# EAGLE design 8255_pio_1_4 (EAGLE 9.6.2)
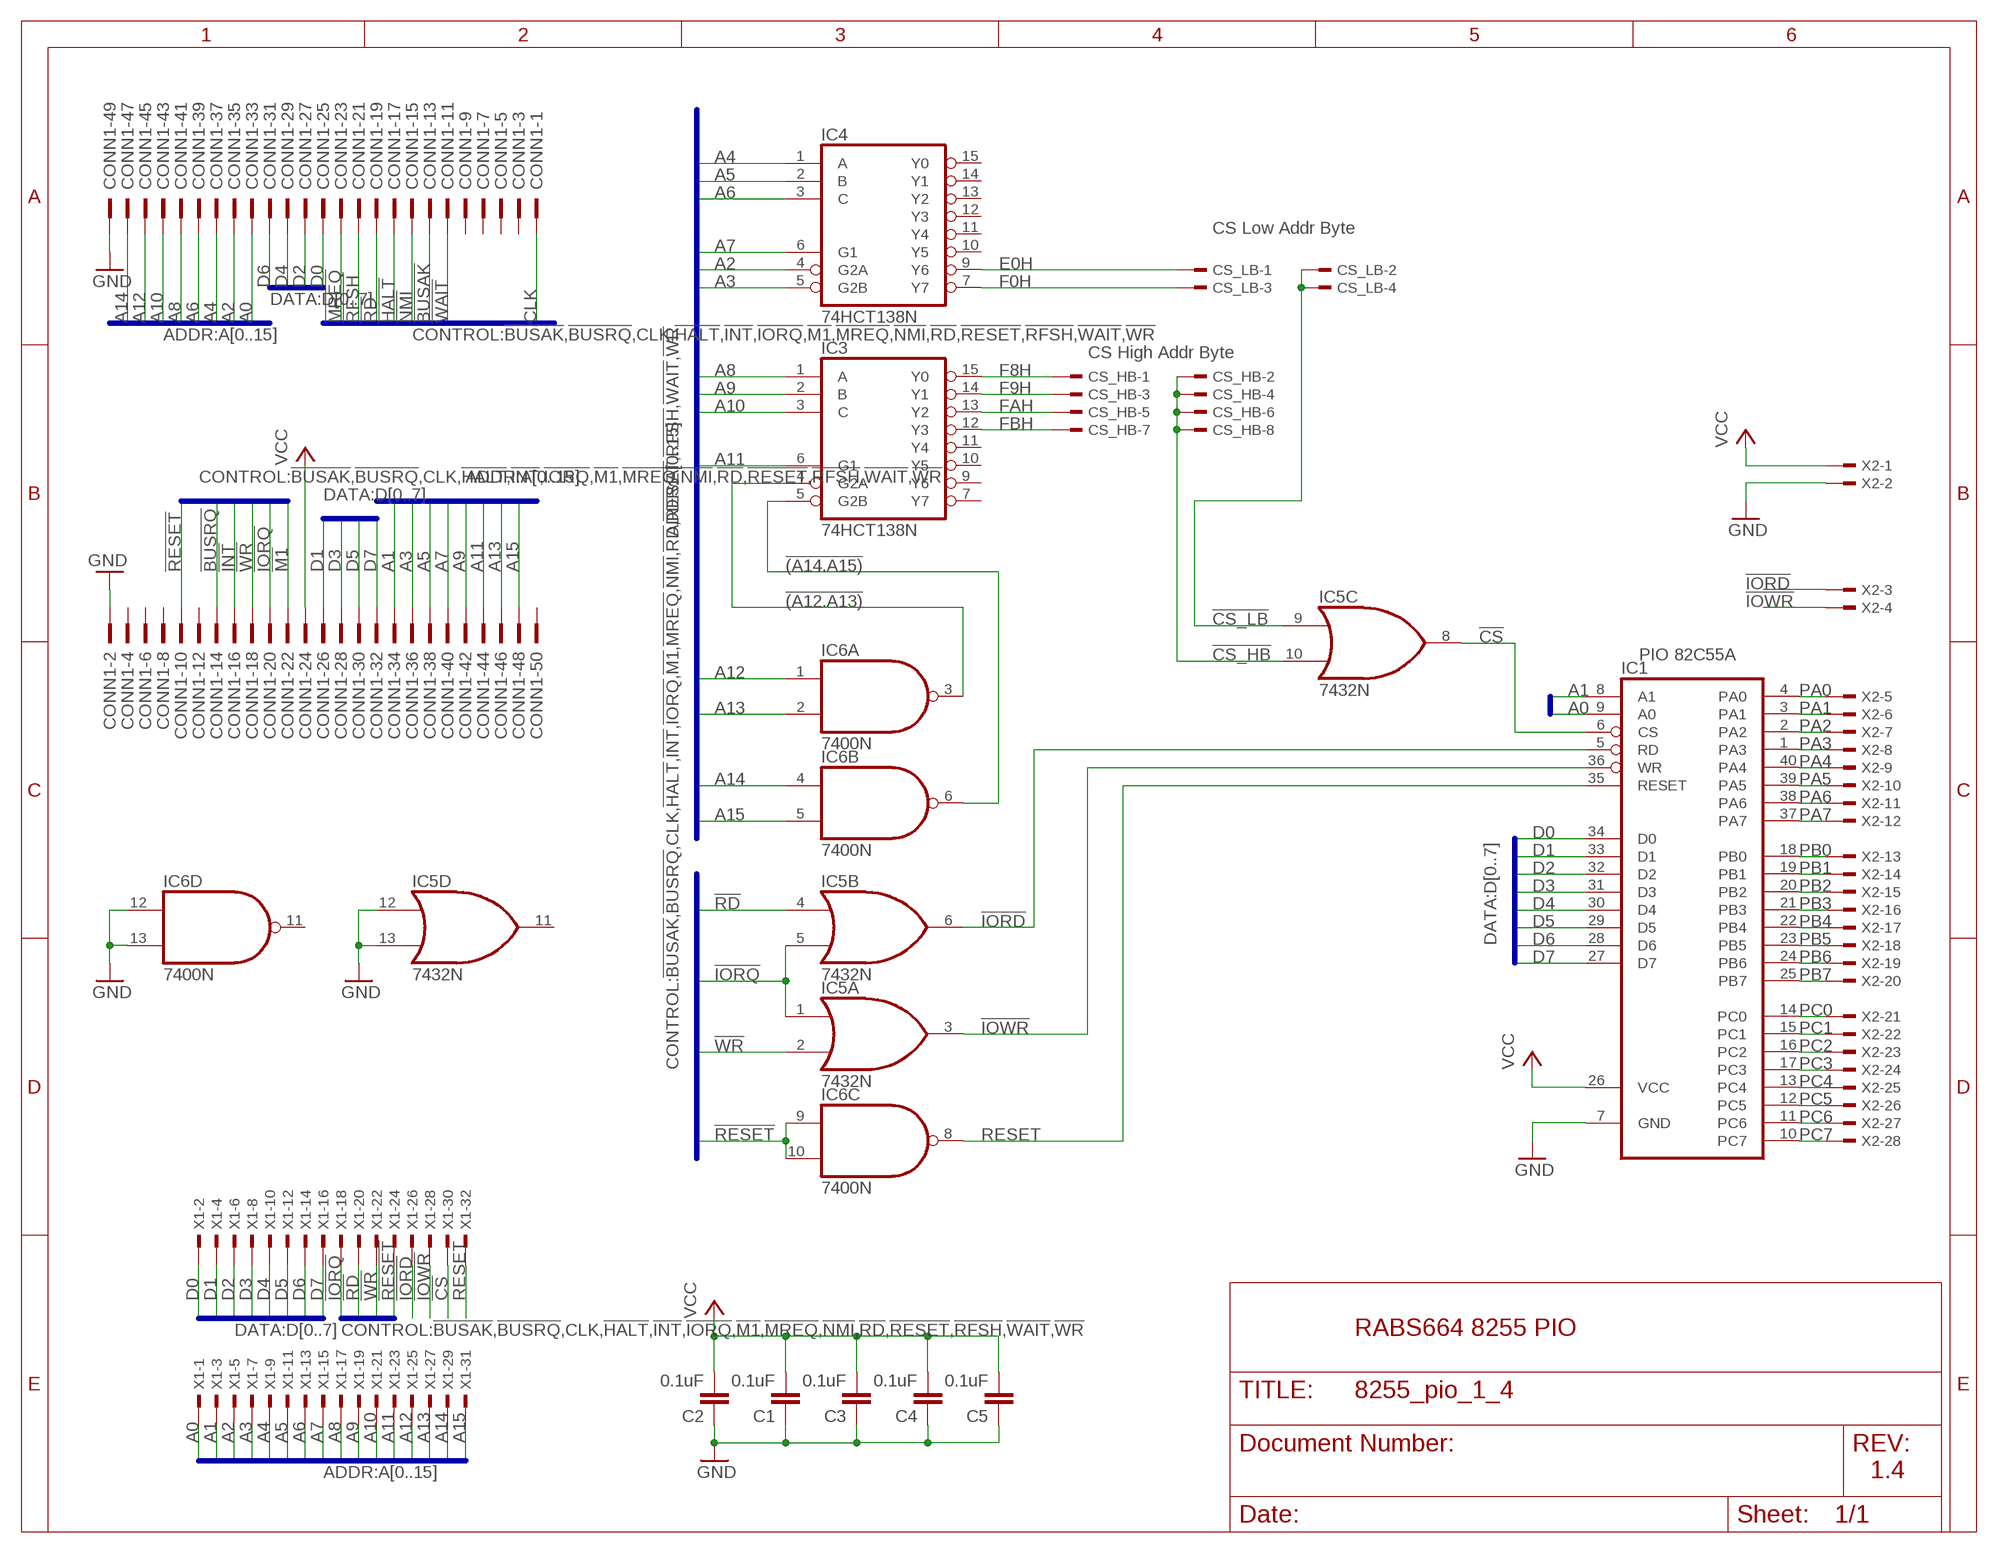
[diagram p0: schematic, sheet 1]

## Parts
C1  0.1uF  C-EU050-025X075  [C050-025X075]
C2  0.1uF  C-EU050-025X075  [C050-025X075]
C3  0.1uF  C-EU050-025X075  [C050-025X075]
C4  0.1uF  C-EU050-025X075  [C050-025X075]
C5  0.1uF  C-EU050-025X075  [C050-025X075]
CONN1  2550-  [PAK100/2500-50]
CS_HB  TSW-104-07-G-D  [TSW-104-XX-G-D]
CS_LB  TSW-102-07-G-D  [TSW-102-XX-G-D]
IC1  82C55A  [DIL40]
IC3  74HCT138N  [DIL16]
IC4  74HCT138N  [DIL16]
IC5  7432N  [DIL14]
IC6  7400N  [DIL14]
X1  TSW-116-07-G-D  [TSW-116-XX-G-D]
X2  TSW-128-07-G-S  [TSW-128-XX-G-S]

## Nets
!(A12.A13): IC3.4(G2A) IC6.3(A:O)
!(A14.A15): IC3.5(G2B) IC6.6(B:O)
!BUSAK: CONN1.13
!BUSRQ: CONN1.14
!CS: IC1.6(CS) IC5.8(C:O) X1.30
!CS_HB: CS_HB.2 CS_HB.4 CS_HB.6 CS_HB.8 IC5.10(C:I1)
!CS_LB: CS_LB.2 CS_LB.4 IC5.9(C:I0)
!HALT: CONN1.17
!INT: CONN1.16
!IORD: IC1.5(RD) IC5.6(B:O) X1.26 X2.3
!IORQ: CONN1.20 IC5.1(A:I0) IC5.5(B:I1) X1.18
!IOWR: IC1.36(WR) IC5.3(A:O) X1.28 X2.4
!M1: CONN1.22
!MREQ: CONN1.23
!NMI: CONN1.15
!RD: CONN1.19 IC5.4(B:I0) X1.20
!RESET: CONN1.10 IC6.9(C:I0) IC6.10(C:I1) X1.24
!RFSH: CONN1.21
!WAIT: CONN1.11
!WR: CONN1.18 IC5.2(A:I1) X1.22
A0: CONN1.33 IC1.9(A0) X1.1
A1: CONN1.34 IC1.8(A1) X1.3
A2: CONN1.35 IC4.4(G2A) X1.5
A3: CONN1.36 IC4.5(G2B) X1.7
A4: CONN1.37 IC4.1(A) X1.9
A5: CONN1.38 IC4.2(B) X1.11
A6: CONN1.39 IC4.3(C) X1.13
A7: CONN1.40 IC4.6(G1) X1.15
A8: CONN1.41 IC3.1(A) X1.17
A9: CONN1.42 IC3.2(B) X1.19
A10: CONN1.43 IC3.3(C) X1.21
A11: CONN1.44 IC3.6(G1) X1.23
A12: CONN1.45 IC6.1(A:I0) X1.25
A13: CONN1.46 IC6.2(A:I1) X1.27
A14: CONN1.47 IC6.4(B:I0) X1.29
A15: CONN1.48 IC6.5(B:I1) X1.31
CLK: CONN1.1
D0: CONN1.25 IC1.34(D0) X1.2
D1: CONN1.26 IC1.33(D1) X1.4
D2: CONN1.27 IC1.32(D2) X1.6
D3: CONN1.28 IC1.31(D3) X1.8
D4: CONN1.29 IC1.30(D4) X1.10
D5: CONN1.30 IC1.29(D5) X1.12
D6: CONN1.31 IC1.28(D6) X1.14
D7: CONN1.32 IC1.27(D7) X1.16
E0H: CS_LB.1 IC4.9(Y6)
F0H: CS_LB.3 IC4.7(Y7)
F8H: CS_HB.1 IC3.15(Y0)
F9H: CS_HB.3 IC3.14(Y1)
FAH: CS_HB.5 IC3.13(Y2)
FBH: CS_HB.7 IC3.12(Y3)
GND [supply]: C1.1 C2.1 C3.1 C4.1 C5.1 CONN1.2 CONN1.49 IC1.7(GND) IC5.12(D:I0) IC5.13(D:I1) IC6.12(D:I0) IC6.13(D:I1) X2.2
PA0: IC1.4(PA0) X2.5
PA1: IC1.3(PA1) X2.6
PA2: IC1.2(PA2) X2.7
PA3: IC1.1(PA3) X2.8
PA4: IC1.40(PA4) X2.9
PA5: IC1.39(PA5) X2.10
PA6: IC1.38(PA6) X2.11
PA7: IC1.37(PA7) X2.12
PB0: IC1.18(PB0) X2.13
PB1: IC1.19(PB1) X2.14
PB2: IC1.20(PB2) X2.15
PB3: IC1.21(PB3) X2.16
PB4: IC1.22(PB4) X2.17
PB5: IC1.23(PB5) X2.18
PB6: IC1.24(PB6) X2.19
PB7: IC1.25(PB7) X2.20
PC0: IC1.14(PC0) X2.21
PC1: IC1.15(PC1) X2.22
PC2: IC1.16(PC2) X2.23
PC3: IC1.17(PC3) X2.24
PC4: IC1.13(PC4) X2.25
PC5: IC1.12(PC5) X2.26
PC6: IC1.11(PC6) X2.27
PC7: IC1.10(PC7) X2.28
RESET: IC1.35(RESET) IC6.8(C:O) X1.32
VCC [supply]: C1.2 C2.2 C3.2 C4.2 C5.2 CONN1.24 IC1.26(VCC) X2.1
Unconnected: CONN1.3 CONN1.4 CONN1.5 CONN1.6 CONN1.7 CONN1.8 CONN1.9 CONN1.12 CONN1.50 IC3.7(Y7) IC3.9(Y6) IC3.10(Y5) IC3.11(Y4) IC4.10(Y5) IC4.11(Y4) IC4.12(Y3) IC4.13(Y2) IC4.14(Y1) IC4.15(Y0) IC5.11(D:O) IC6.11(D:O)

## Buses
ADDR:A[0..15]
DATA:D[0..7]
CONTROL:!BUSAK,!BUSRQ,CLK,!HALT,!INT,!IORQ,!M1,!MREQ,!NMI,!RD,!RESET,!RFSH,!WAIT,!WR

## Notes on the sheet
- CS Low Addr Byte
- CS High Addr Byte
- PIO 82C55A
- RABS664 8255 PIO
- 1.4

## Power pins joined to a net without a drawn wire
GND: IC3.8(GND) IC4.8(GND) IC5.7(P:GND) IC6.7(P:GND)
VCC: IC3.16(VCC) IC4.16(VCC) IC5.14(P:VCC) IC6.14(P:VCC)

## Library data of the parts
C1-C5 = rcl:C-EU: CAPACITOR, European symbol; SPICEPREFIX: C
CONN1 = con-3m:2550-: 3M (TM) Pak 100 4-Wall Header Source: 3M; OC_FARNELL: unknown; OC_NEWARK: unknown; SPICEPREFIX: X
CS_HB = con-samtec:TSW-104-*-G: THROUGH-HOLE .025" SQ POST HEADER Source: Samtec TSW.pdf; MF: Samtec Inc.; MPN: TSW-104-07-G-D
CS_LB = con-samtec:TSW-102-*-G: THROUGH-HOLE .025" SQ POST HEADER Source: Samtec TSW.pdf; MF: Samtec Inc.; MPN: TSW-102-07-G-D
IC1 = micro-intel:82C55A: MICROCOMPUTER/PERIPHERAL DEVICE; MF: INTERSIL; MPN: IP82C55AZ; OC_FARNELL: 1562050; OC_NEWARK: 79K6939
IC3 IC4 = 74xx-eu:74*138: 3-line to 8-line DECODER/DEMULTIPLEXER
IC5 = 74xx-us:74*32: Quad 2-input OR gate
IC6 = 74xx-us:74*00: Quad 2-input NAND gate
X1 = con-samtec:TSW-116-*-G: THROUGH-HOLE .025" SQ POST HEADER Source: Samtec TSW.pdf; MF: Samtec Inc.; MPN: TSW-116-07-G-D
X2 = con-samtec:TSW-128-*-G-S: THROUGH-HOLE .025" SQ POST HEADER Source: Samtec TSW.pdf; MF: Samtec Inc.; MPN: TSW-128-07-G-S

## Net classes
0 default: width 0.254 mm, clearance 0.254 mm
1 supply: width 0.508 mm, clearance 0.508 mm

## Board
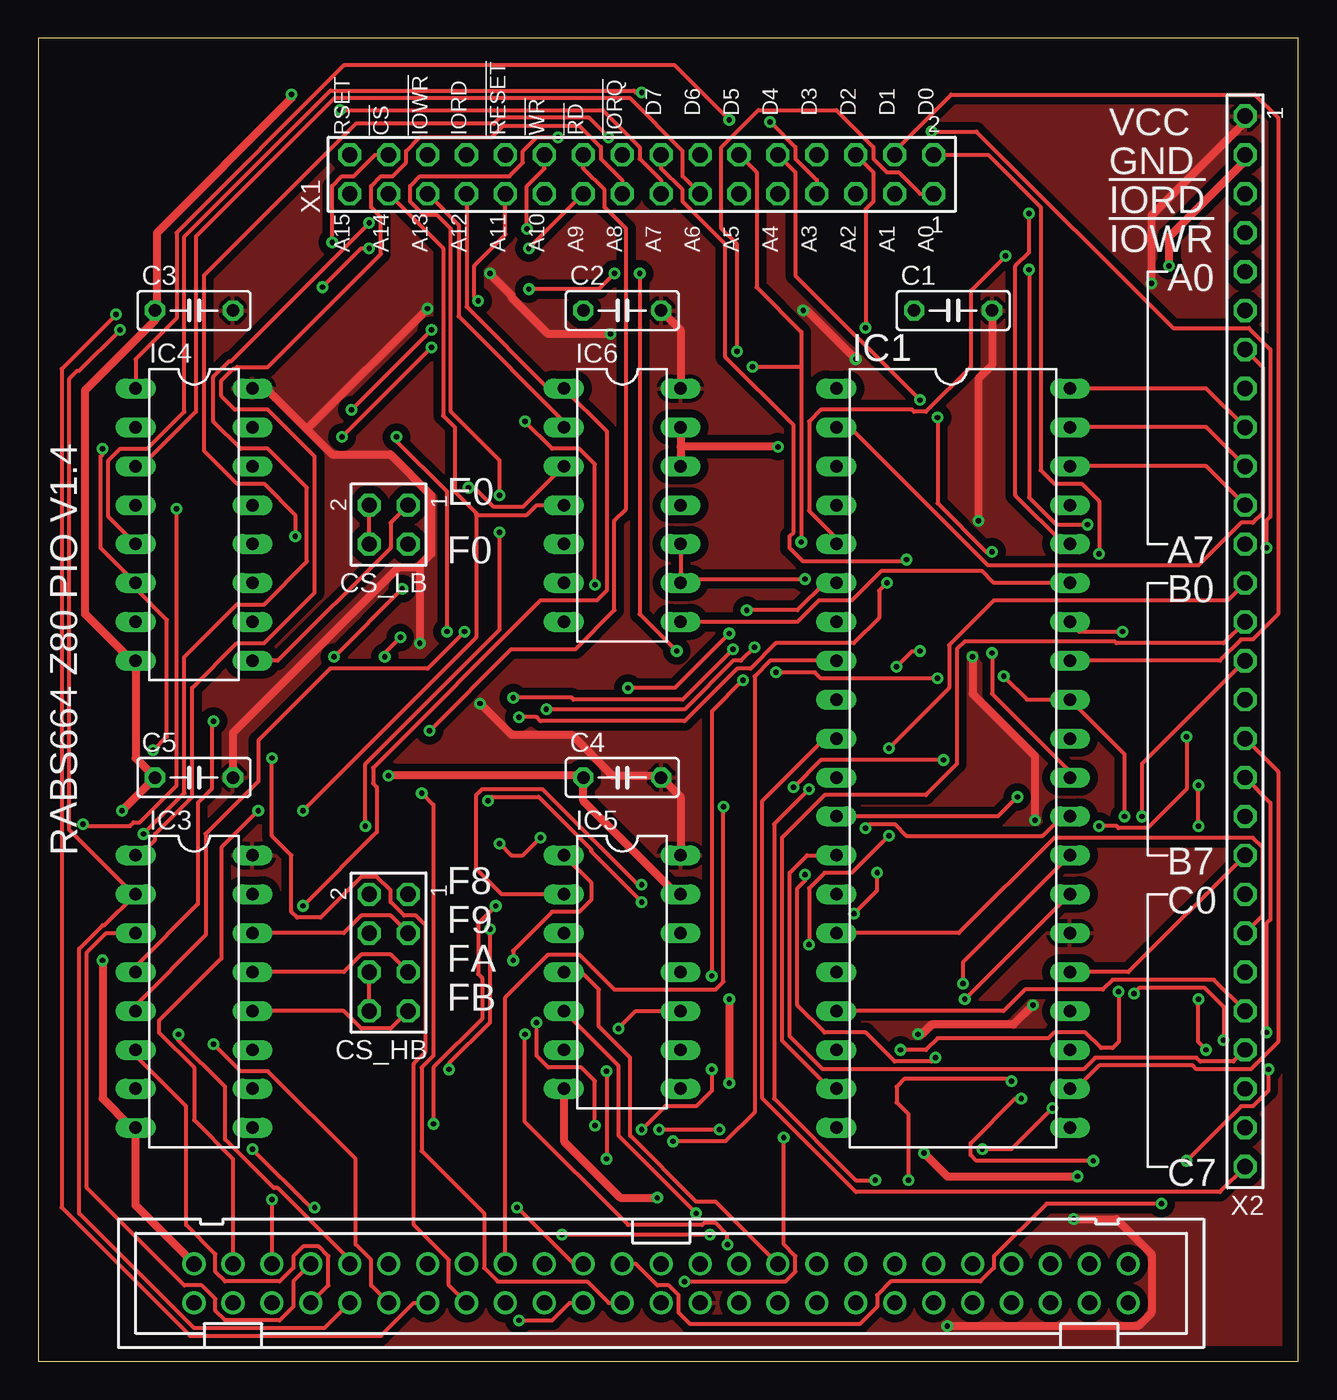
[diagram p1: board, top side]
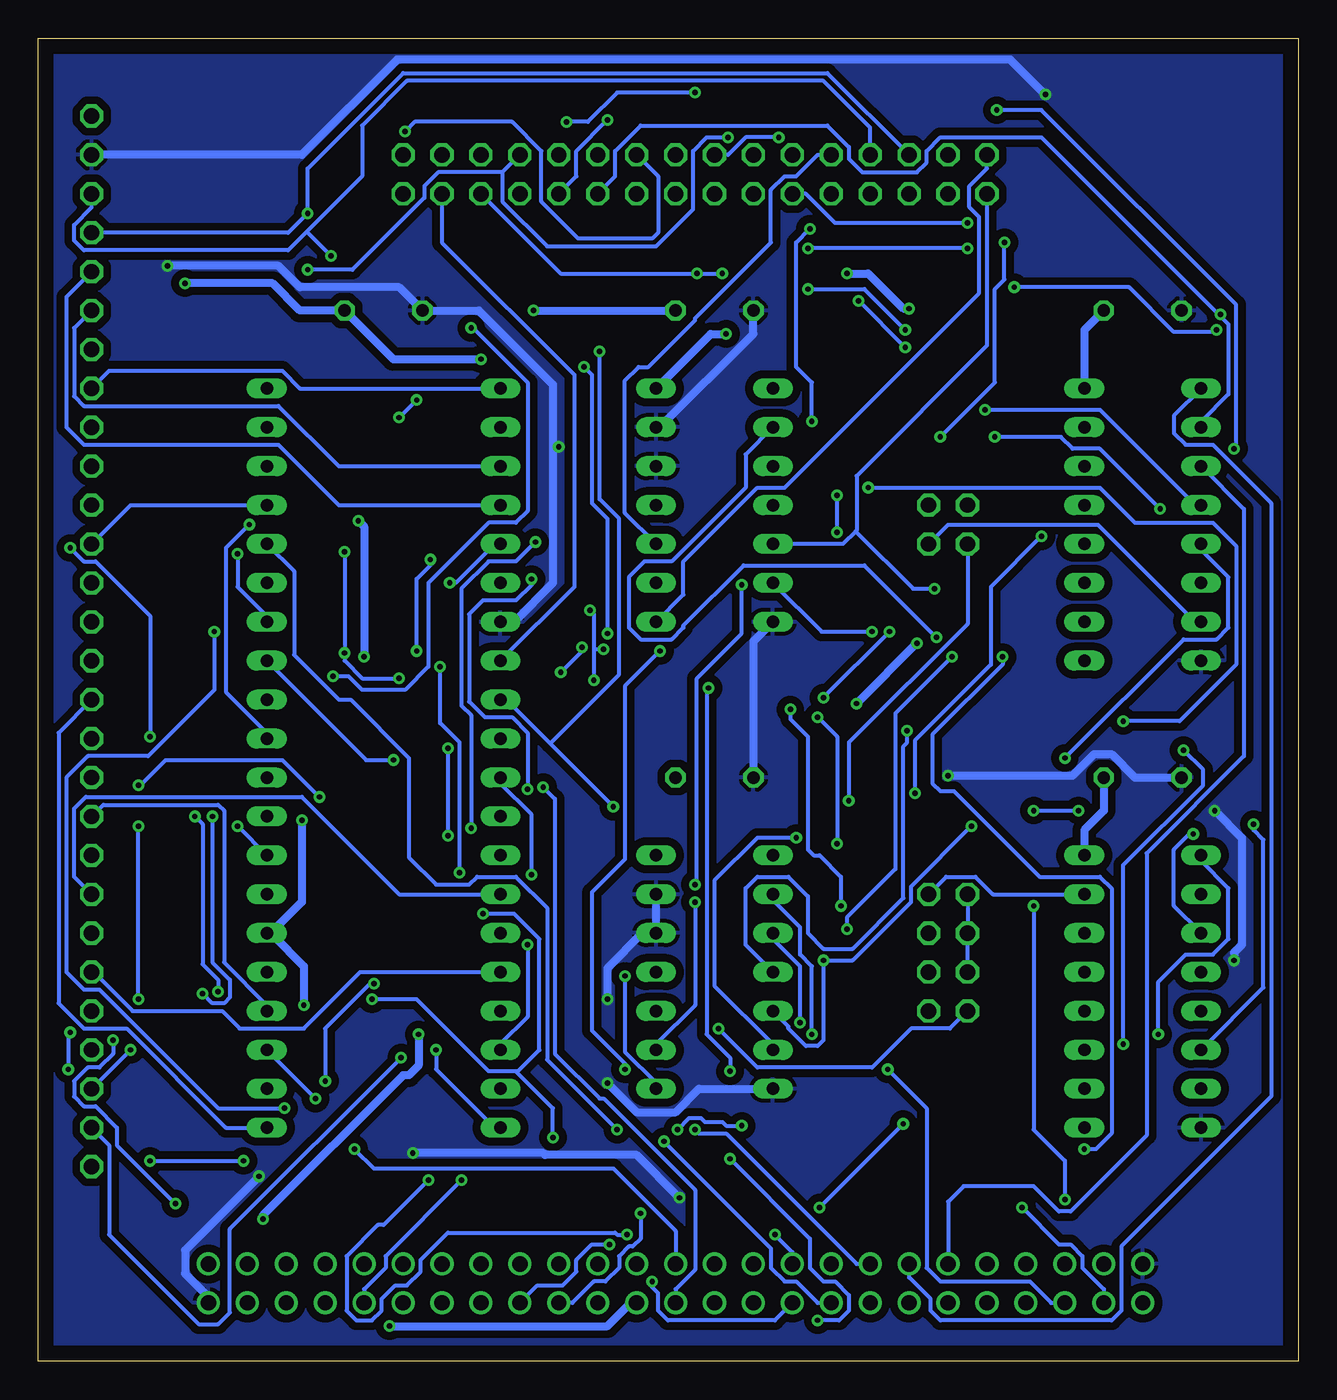
[diagram p2: board, bottom side, seen from below]

Size 82.22 x 86.35 mm. Coordinates in mm from the lower left corner, seen from the top.
Outline: 0,0 82.22,0 82.22,86.35 0,86.35 0,0
Copper layers (1*16): Top 0.035mm / dielectric 1.5mm / Bottom 0.035mm
Design rules "default": minimum track width 6mil, minimum drill 0.35mm, track to track 6mil, track to pad 6mil, pad to pad 6mil, via to via 6mil, smd to smd 6mil, copper to edge 40mil, drill to drill 6mil, minimum pad ring 10mil, minimum via ring 8mil, stop-mask expansion 4mil, vias tented up to drill 0mil, thermal gap 10mil

### Footprints (pad centres in the part's own frame; a part is rotated, then mirrored left to right if it is on the bottom)
C050-025X075 = drill 0.813 octagon: 1 -2.54,0; 2 2.54,0
PAK100/2500-50 = drill 1 pad 1.422: 1 -30.48,-1.27; 2 -30.48,1.27; 3 -27.94,-1.27; 4 -27.94,1.27; 5 -25.4,-1.27; 6 -25.4,1.27; 7 -22.86,-1.27; 8 -22.86,1.27; 9 -20.32,-1.27; 10 -20.32,1.27; 11 -17.78,-1.27; 12 -17.78,1.27; 13 -15.24,-1.27; 14 -15.24,1.27; 15 -12.7,-1.27; 16 -12.7,1.27; 17 -10.16,-1.27; 18 -10.16,1.27; 19 -7.62,-1.27; 20 -7.62,1.27; 21 -5.08,-1.27; 22 -5.08,1.27; 23 -2.54,-1.27; 24 -2.54,1.27; 25 0,-1.27; 26 0,1.27; 27 2.54,-1.27; 28 2.54,1.27; 29 5.08,-1.27; 30 5.08,1.27; 31 7.62,-1.27; 32 7.62,1.27; 33 10.16,-1.27; 34 10.16,1.27; 35 12.7,-1.27; 36 12.7,1.27; 37 15.24,-1.27; 38 15.24,1.27; 39 17.78,-1.27; 40 17.78,1.27; 41 20.32,-1.27; 42 20.32,1.27; 43 22.86,-1.27; 44 22.86,1.27; 45 25.4,-1.27; 46 25.4,1.27; 47 27.94,-1.27; 48 27.94,1.27; 49 30.48,-1.27; 50 30.48,1.27
TSW-104-XX-G-D = drill 1 pad 1.5 octagon: 1 3.81,-1.27; 2 3.81,1.27; 3 1.27,-1.27; 4 1.27,1.27; 5 -1.27,-1.27; 6 -1.27,1.27; 7 -3.81,-1.27; 8 -3.81,1.27
TSW-102-XX-G-D = drill 1 pad 1.5 octagon: 1 1.27,-1.27; 2 1.27,1.27; 3 -1.27,-1.27; 4 -1.27,1.27
DIL40 = drill 0.813 long: 1 -24.13,-7.62; 2 -21.59,-7.62; 3 -19.05,-7.62; 4 -16.51,-7.62; 5 -13.97,-7.62; 6 -11.43,-7.62; 7 -8.89,-7.62; 8 -6.35,-7.62; 9 -3.81,-7.62; 10 -1.27,-7.62; 11 1.27,-7.62; 12 3.81,-7.62; 13 6.35,-7.62; 14 8.89,-7.62; 15 11.43,-7.62; 16 13.97,-7.62; 17 16.51,-7.62; 18 19.05,-7.62; 19 21.59,-7.62; 20 24.13,-7.62; 21 24.13,7.62; 22 21.59,7.62; 23 19.05,7.62; 24 16.51,7.62; 25 13.97,7.62; 26 11.43,7.62; 27 8.89,7.62; 28 6.35,7.62; 29 3.81,7.62; 30 1.27,7.62; 31 -1.27,7.62; 32 -3.81,7.62; 33 -6.35,7.62; 34 -8.89,7.62; 35 -11.43,7.62; 36 -13.97,7.62; 37 -16.51,7.62; 38 -19.05,7.62; 39 -21.59,7.62; 40 -24.13,7.62
DIL16 = drill 0.813 long: 1 -8.89,-3.81; 2 -6.35,-3.81; 3 -3.81,-3.81; 4 -1.27,-3.81; 5 1.27,-3.81; 6 3.81,-3.81; 7 6.35,-3.81; 8 8.89,-3.81; 9 8.89,3.81; 10 6.35,3.81; 11 3.81,3.81; 12 1.27,3.81; 13 -1.27,3.81; 14 -3.81,3.81; 15 -6.35,3.81; 16 -8.89,3.81
DIL14 = drill 0.813 long: 1 -7.62,-3.81; 2 -5.08,-3.81; 3 -2.54,-3.81; 4 0,-3.81; 5 2.54,-3.81; 6 5.08,-3.81; 7 7.62,-3.81; 8 7.62,3.81; 9 5.08,3.81; 10 2.54,3.81; 11 0,3.81; 12 -2.54,3.81; 13 -5.08,3.81; 14 -7.62,3.81
TSW-116-XX-G-D = drill 1 pad 1.5 octagon: 1 19.05,-1.27; 2 19.05,1.27; 3 16.51,-1.27; 4 16.51,1.27; 5 13.97,-1.27; 6 13.97,1.27; 7 11.43,-1.27; 8 11.43,1.27; 9 8.89,-1.27; 10 8.89,1.27; 11 6.35,-1.27; 12 6.35,1.27; 13 3.81,-1.27; 14 3.81,1.27; 15 1.27,-1.27; 16 1.27,1.27; 17 -1.27,-1.27; 18 -1.27,1.27; 19 -3.81,-1.27; 20 -3.81,1.27; 21 -6.35,-1.27; 22 -6.35,1.27; 23 -8.89,-1.27; 24 -8.89,1.27; 25 -11.43,-1.27; 26 -11.43,1.27; 27 -13.97,-1.27; 28 -13.97,1.27; 29 -16.51,-1.27; 30 -16.51,1.27; 31 -19.05,-1.27; 32 -19.05,1.27
TSW-128-XX-G-S = drill 1 pad 1.5 octagon: 1 34.29,0; 2 31.75,0; 3 29.21,0; 4 26.67,0; 5 24.13,0; 6 21.59,0; 7 19.05,0; 8 16.51,0; 9 13.97,0; 10 11.43,0; 11 8.89,0; 12 6.35,0; 13 3.81,0; 14 1.27,0; 15 -1.27,0; 16 -3.81,0; 17 -6.35,0; 18 -8.89,0; 19 -11.43,0; 20 -13.97,0; 21 -16.51,0; 22 -19.05,0; 23 -21.59,0; 24 -24.13,0; 25 -26.67,0; 26 -29.21,0; 27 -31.75,0; 28 -34.29,0

### Placement (x,y rotation side)
C1  59.69,68.58 0 top
C2  38.1,68.58 0 top
C3  10.16,68.58 0 top
C4  38.1,38.1 0 top
C5  10.16,38.1 0 top
CONN1  40.64,5.08 180 top
CS_HB  22.86,26.67 90 top
CS_LB  22.86,54.61 90 top
IC1  59.69,39.37 270 top
IC3  10.16,24.13 270 top
IC4  10.16,54.61 270 top
IC5  38.1,25.4 270 top
IC6  38.1,55.88 270 top
X1  39.37,77.47 0 top
X2  78.74,46.99 90 top

### Tracks (layer width: path | path; a pad name or v marks a point on that pad's centre or on a via)
!(A12.A13)  (via drill 0.35)
  Top 0.254: IC3.4 6.35,25.78 10.41,29.84 10.41,36.45 11.3,37.34 11.3,41.66 v11.43,41.78 | v28.07,57.02 28.45,57.02 29.72,55.75 31.62,55.75 IC6.3
  Bottom 0.254: v11.43,41.78 7.75,41.78 4.06,45.47 4.06,53.21 5.59,54.74 10.67,54.74 12.95,57.02 v28.07,57.02
!(A14.A15)  (via drill 0.35)
  Top 0.254: IC3.5 6.35,23.24 10.92,27.81 10.92,34.42 14.35,37.85 14.35,40.51 19.05,45.21 25.4,45.21 v27.81,47.62
  Bottom 0.254: v27.81,47.62 31.11,47.62 IC6.6
!CS  (via drill 0.35)
  Top 0.254: v43.94,25.15 43.94,42.42 v45.97,44.45 | v46.23,49.02 49.53,49.02 51.31,50.8 IC1.6 | X1.30 21.97,78.74 20.57,77.34 19.81,77.34 19.18,76.71 v19.18,73.03 | v23.37,60.33 23.37,60.07 26.67,56.77 v26.67,47.62 | v30.99,43.31 34.8,43.31 34.92,43.18 42.04,43.18 v45.34,46.48
  Bottom 0.254: IC5.8 41.91,18.16 43.94,20.19 v43.94,25.15 | 45.97,46.48 45.97,48.77 v46.23,49.02 | 45.97,46.48 v45.97,44.45 | v19.18,73.03 19.18,70.61 19.81,69.98 19.81,63.88 v23.37,60.33 | v30.99,43.31 v26.67,47.62 | 45.97,46.48 v45.34,46.48
!CS_HB  (via drill 0.35)
  Top 0.254: IC5.10 38.99,22.86 v37.85,21.72 | CS_HB.8 CS_HB.6
  Bottom 0.254: CS_HB.2 CS_HB.4 CS_HB.6 | v37.85,21.72 35.31,19.18 27.81,19.18 25.27,21.72 22.73,21.72 CS_HB.8
!CS_LB  (via drill 0.35)
  Top 0.254: v39.37,29.97 36.07,33.27 36.07,33.4 32.64,36.83 29.59,36.83 v29.34,36.58 | CS_LB.4 CS_LB.2
  Bottom 0.254: IC5.9 41.91,20.7 39.37,23.24 v39.37,29.97 | v29.34,36.58 29.34,40.39 21.59,48.13 CS_LB.4
!IORD  (via drill 0.35)
  Top 0.254: v32.77,34.16 31.62,33.02 30.86,33.02 v30.1,33.78 | v31.37,42.04 32.51,42.04 32.77,41.78 42.16,41.78 45.59,45.21 46.48,45.21 48.13,46.86 53.21,46.86 54.86,48.51 54.86,50.29 v55.37,50.8 | IC1.5 52.07,53.72 50.29,55.5 50.29,61.34 51.05,62.1 57.02,62.1 57.15,61.98 57.91,61.98 60.83,64.9 60.83,69.85 v63.12,72.14
  Bottom 0.254: IC5.6 34.29,20.7 38.1,24.51 38.1,31.37 35.31,34.16 v32.77,34.16 | v30.1,33.78 30.1,40.77 v31.37,42.04 | v55.37,50.8 54.99,50.8 52.45,53.34 IC1.5 | X2.3 78.74,75.31 79.88,74.17 79.88,73.15 79.25,72.52 65.91,72.52 64.71,73.72 | 64.71,73.72 61.09,77.34 61.09,80.64 58.17,83.57 30.99,83.57 27.94,80.52 X1.26 | 64.71,73.72 v63.12,72.14
!IORQ  (via drill 0.35)
  Top 0.254: v30.99,26.16 30.99,26.8 33.53,29.34 35.31,29.34 36.07,30.1 36.07,31.24 IC5.1 | v33.91,79.88 32.51,79.88 31.62,78.99 31.62,78.23 30.73,77.34 24.89,77.34 24.26,76.71 24.26,75.69 25.15,74.8 26.04,74.8 26.92,73.91 26.92,61.98 30.1,58.8 v30.1,56.52 | v30.1,54.1 30.1,47.75 21.34,38.99 v21.34,34.92 | v42.93,9.65 37.85,14.73 37.85,19.3 IC5.5
  Bottom 0.254: IC5.5 33.27,21.84 33.27,21.72 32.13,20.57 31.37,20.57 30.99,20.95 v30.99,26.16 29.08,26.16 25.27,29.97 25.27,30.99 v21.34,34.92 | X1.18 37.21,78.74 36.07,79.88 v33.91,79.88 | v30.1,54.1 v30.1,56.52 | CONN1.20 47.37,3.81 45.97,5.21 45.21,5.21 44.32,6.1 44.32,6.86 43.69,7.49 43.43,7.49 42.93,8 v42.93,9.65
!IOWR  (via drill 0.35)
  Top 0.254: v32.51,22.1 32.51,19.94 33.27,19.18 35.43,19.18 36.32,18.29 v36.32,15.37 | v44.45,15.11 v40.51,15.11 | v64.64,74.93 64.64,72.39 63.75,71.5 63.75,56.52 66.93,53.34 IC1.36
  Bottom 0.254: IC5.3 34.29,27.56 32.51,25.78 v32.51,22.1 | v36.32,15.37 37.34,15.37 37.59,15.62 38.73,15.62 38.99,15.88 39.75,15.88 v40.51,15.11 | v44.45,15.11 49.02,19.68 49.02,29.59 51.05,31.62 53.59,31.62 54.1,31.11 56.26,31.11 58.04,32.89 58.04,39.37 61.85,43.18 62.61,43.18 65.53,46.1 65.53,51.56 IC1.36 | X2.4 65.91,73.66 v64.64,74.93 64.64,77.85 58.42,84.07 30.73,84.07 X1.28
!RD  (via drill 0.35)
  Top 0.254: IC5.4 35.43,25.4 36.58,24.26 36.58,21.84 38.61,19.81 38.61,14.73 42.93,10.41 44.2,10.41 CONN1.19 | X1.20 35.56,77.85 36.96,76.45 36.96,75.31 38.35,73.91 38.35,55.63 37.59,54.86 37.59,49.02 35.05,46.48 30.86,46.48 v25.53,41.15
  Bottom 0.254: v25.53,41.15 25.53,40.39 25.78,40.13 25.78,30.23 29.08,26.92 30.99,26.92 32,27.94 32,30.35 33.27,31.62 35.31,31.62 36.07,30.86 36.07,27.18 IC5.4
!RESET  (via drill 0.35)
  Top 0.254: IC6.10 41.91,51.05 | v54.61,11.81 53.34,11.81 48.01,17.14 48.01,35.05 v50.29,37.34 | 41.91,51.05 v50.04,51.05 | 41.91,51.05 IC6.9
  Bottom 0.254: CONN1.10 60.96,4.7 59.56,6.1 59.56,6.86 v54.61,11.81 | v50.29,37.34 50.29,41.02 51.31,42.04 53.09,42.04 54.1,43.05 54.1,48.77 53.21,49.66 51.05,49.66 50.04,50.67 v50.04,51.05 | X1.24 31.37,78.74 32.77,77.34 33.53,77.34 34.42,76.45 34.42,73.03 39.37,68.07 39.37,67.94 42.42,64.9 43.05,64.9 43.94,64.01 43.94,55.37 IC6.10
!WR  (via drill 0.35)
  Top 0.254: v31.75,21.34 31.75,15.62 38.48,8.89 43.31,8.89 43.43,9.02 44.2,9.02 44.96,8.26 v44.96,7.62 | X1.22 33.02,77.85 31.88,76.71 v31.88,73.91 | v31.75,61.34 33.53,59.56 35.31,59.56 36.32,58.55 v36.32,50.67 | v39.37,31.11 39.12,31.11 32.89,37.34 28.96,37.34 28.57,36.96 28.57,32.13 30.23,30.48 IC5.2
  Bottom 0.254: IC5.2 34.29,30.1 32.51,28.32 32.51,26.54 31.75,25.78 v31.75,21.34 | v44.96,7.62 46.1,7.62 47.12,6.6 47.12,5.84 48.01,4.95 49.66,4.95 CONN1.18 | v31.88,73.91 32.77,73.03 32.77,64.9 31.75,63.88 v31.75,61.34 | v36.32,50.67 36.32,47.5 39.24,44.58 39.24,31.24 v39.37,31.11
A0  (via drill 0.35)
  Top 0.254: v44.7,36.2 44.7,24.77 44.2,24.26 37.59,24.26 35.31,26.54 33.27,26.54 30.48,23.75 CONN1.33 | X1.1 57.53,76.2 56.13,77.6 55.37,77.6 54.48,78.49 54.48,79.25 52.07,81.66 46.99,81.66 44.58,79.25 44.58,73.91 45.59,72.9 v45.59,65.91
  Bottom 0.254: IC1.9 51.69,43.18 48.83,40.32 | v44.7,36.2 48.83,40.32 | v45.59,65.91 45.59,56.26 44.32,54.99 44.32,44.83 48.83,40.32
A1  (via drill 0.35)
  Top 0.254: v41.4,14.35 44.83,14.35 46.74,16.26 46.74,44.7 47.75,45.72 IC1.8
  Bottom 0.254: IC1.8 47.24,50.55 47.24,64.39 55.88,73.03 X1.3 | CONN1.34 31.37,3.81 32.77,5.21 33.53,5.21 34.42,6.1 34.42,7.37 v41.4,14.35
A2  (via drill 0.35)
  Top 0.254: v25.65,67.31 v20.45,62.1 | v32,69.98 36.58,69.98 v37.59,70.99 | v39.37,15.11 40.89,16.64 42.93,16.64 43.94,17.65 v43.94,19.05 | v41.66,46.35 39.24,48.77 v39.24,70.99
  Bottom 0.254: IC4.4 6.73,55.88 12.95,62.1 v20.45,62.1 | v25.65,67.31 28.32,69.98 v32,69.98 | v37.59,70.99 v39.24,70.99 48.13,70.99 X1.5 | CONN1.35 28.83,6.35 37.34,14.86 39.12,14.86 v39.37,15.11 | v43.94,19.05 43.94,19.43 46.1,21.59 46.1,30.61 43.94,32.77 43.94,44.07 v41.66,46.35
A3  (via drill 0.35)
  Top 0.254: v15.24,39.37 15.24,34.29 16.51,33.02 16.51,29.34 16.89,28.96 18.41,28.96 21.08,31.62 22.1,31.62 22.99,30.73 22.99,29.97 23.88,29.08 24.64,29.08 25.27,28.45 25.27,20.19 24.51,19.43 24.51,8.89 26.8,6.6 26.8,4.95 CONN1.36 | X1.7 50.8,77.09 49.4,78.49 49.4,79.25 v47.75,80.9 | v39.37,82.8 38.99,82.8 38.86,82.93 19.05,82.93 9.53,73.41 9.53,61.98 7.11,59.56 5.33,59.56 4.57,58.8 4.57,55.12 IC4.5
  Bottom 0.254: IC4.5 6.35,52.96 4.57,51.18 4.57,47.88 5.33,47.12 7.49,47.12 v15.24,39.37 | v47.75,80.9 46.35,80.9 44.45,82.8 v39.37,82.8
A4  (via drill 0.35)
  Top 0.254: IC4.1 6.35,65.41 9.02,68.07 9.02,73.66 19.94,84.58 41.53,84.58 v45.09,81.03
  Bottom 0.254: v45.09,81.03 47.12,78.99 47.12,77.34 X1.9 | CONN1.37 25.4,5.46 24,4.06 24,3.3 23.37,2.67 12.19,2.67 11.56,3.3 11.56,7.49 1.78,17.27 1.78,56.01 5.59,59.82 7.37,59.82 8.13,60.58 8.13,61.72 IC4.1
A5  (via drill 0.35)
  Top 0.254: CONN1.38 24.51,3.81 22.35,1.65 9.91,1.65 1.52,10.03 1.52,64.77 v5.08,68.33
  Bottom 0.254: IC4.2 6.35,61.34 4.57,63.12 4.57,67.69 5.14,68.26 | 5.14,68.26 16.76,79.88 23.37,79.88 24.26,78.99 24.26,78.23 24.89,77.6 28.45,77.6 29.34,78.49 29.34,79.25 30.73,80.64 42.93,80.64 44.58,78.99 44.58,77.34 X1.11 | v5.08,68.33 5.14,68.26
A6
  Top 0.254: IC4.3 6.73,58.42 10.29,61.98 10.29,73.41 19.3,82.42 38.61,82.42 42.04,78.99 42.04,77.34 X1.13
  Bottom 0.254: CONN1.39 22.86,10.41 21.84,11.43 17.27,11.43 15.62,9.78 14.86,9.78 9.91,14.73 9.91,33.15 3.56,39.5 3.56,55.63 IC4.3
A7  (via drill 0.35)
  Top 0.254: v7.49,39.88 8.38,40.77 8.38,48.39 6.35,50.42 IC4.6 4.06,53.09 4.06,59.05 4.19,59.18 v4.19,59.56 | v11.43,20.7 13.21,18.92 14.99,18.92 20.7,13.21 20.7,7.62 21.72,6.6 21.72,4.95 CONN1.40 | X1.15 40.64,77.09 39.24,78.49 39.24,79.25 36.83,81.66 v19.68,81.66
  Bottom 0.254: v7.49,39.88 6.22,38.61 6.22,37.59 11.43,32.38 v11.43,20.7 | v19.68,81.66 16.76,81.66 4.06,68.96 4.06,59.69 v4.19,59.56
A8  (via drill 0.35)
  Top 0.254: v9.14,21.34 9.14,20.95 12.19,17.91 12.19,14.48 15.37,11.3 15.62,11.3 20.32,6.6 CONN1.41 | X1.17 38.1,77.09 36.7,78.49 36.7,79.25 35.31,80.64 30.35,80.64 29.59,79.88 24.89,79.88 24,78.99 24,78.23 23.11,77.34 22.35,77.34 21.72,76.71 21.72,75.31 22.35,74.68 22.35,72.26 14.99,64.9 12.95,64.9 12.83,64.77 12.7,64.77 11.94,64.01 11.94,62.99 12.83,62.1 14.99,62.1 18.03,59.05 18.03,50.16 14.73,46.86 12.95,46.86 10.03,43.94 10.03,36.83 7.62,34.42 7.62,34.04 6.6,33.02 IC3.1
  Bottom 0.254: IC3.1 6.35,32.64 4.57,30.86 4.57,27.56 5.59,26.54 7.37,26.54 9.14,24.77 v9.14,21.34
A9  (via drill 0.35)
  Top 0.254: CONN1.42 18.67,2.16 10.16,2.16 2.67,9.65 2.67,26.92 4.19,28.45 4.32,28.45 IC3.2 6.22,30.48 2.03,34.67 2.03,64.14 2.54,64.64 2.67,64.64 v5.33,67.31 | v32,72.64 X1.19 | v21.59,72.64 21.08,72.64 v18.54,70.1
  Bottom 0.254: v21.59,72.64 v32,72.64 | v18.54,70.1 11.05,70.1 8.13,67.18 5.46,67.18 v5.33,67.31
A10  (via drill 0.35)
  Top 0.254: IC3.3 4.45,27.94 3.17,26.67 3.17,11.3 9.53,4.95 10.67,4.95 11.56,4.06 11.56,3.3 12.19,2.67 15.75,2.67 16.64,3.56 16.64,5.21 CONN1.43 | v21.59,74.3 12.57,65.28 12.45,65.28 11.43,64.26 11.43,61.34 13.21,59.56 14.99,59.56 17.53,57.02 17.53,52.2 14.73,49.4 12.95,49.4 9.53,45.97 9.53,37.08 v6.86,34.42
  Bottom 0.254: X1.21 32.13,76.2 30.23,74.3 v21.59,74.3 | v6.86,34.42 7.11,34.42 8.13,33.4 8.13,29.72 IC3.3
A11  (via drill 0.35)
  Top 0.254: IC3.6 6.35,19.94 9.65,16.64 9.65,8.89 11.56,6.99 11.56,5.84 12.19,5.21 15.75,5.21 16.64,6.1 16.64,6.86 17.27,7.49 18.29,7.49 18.92,6.86 18.92,4.95 CONN1.44 | X1.23 30.48,73.53 28.45,71.5 28.45,69.47 v28.7,69.22 | v19.81,60.33 v25.65,66.17 | v9.02,55.63 9.02,37.59 6.6,35.18 6.22,35.18 5.97,34.92 3.05,34.92 v2.92,35.05
  Bottom 0.254: v25.65,66.17 v28.7,69.22 | v19.81,60.33 15.49,60.33 14.73,59.56 12.95,59.56 v9.02,55.63 | v2.92,35.05 2.92,34.67 2.29,34.04 2.29,24.38 IC3.6
A12  (via drill 0.35)
  Top 0.254: X1.25 27.94,68.83 33.27,63.5 IC6.1 37.08,60.71 37.08,50.29 36.45,49.66 32.77,49.66 21.84,38.73 21.84,37.72 22.1,37.47 22.1,34.54 v17.27,29.72 | v15.24,10.54 CONN1.45
  Bottom 0.254: v15.24,10.54 15.24,13.08 17.27,15.11 v17.27,29.72
A13  (via drill 0.35)
  Top 0.254: IC6.2 34.29,61.34 27.43,68.2 27.43,74.17 X1.27 | v26.8,19.05 26.8,19.43 29.46,22.1 v29.46,28.19 | v22.61,45.97 22.61,46.23 v23.62,47.24
  Bottom 0.254: CONN1.46 16.13,3.81 17.53,5.21 23.37,5.21 24.26,6.1 24.26,16.51 v26.8,19.05 | v29.46,28.19 29.46,28.96 26.29,32.13 26.29,42.29 v22.61,45.97 | v23.62,47.24 28.32,51.94 36.2,51.94 40.13,48.01 40.13,47.88 40.89,47.12 42.93,47.12 43.69,47.88 43.69,51.18 42.67,52.2 40.89,52.2 36.07,57.02 36.07,59.18 IC6.2
A14  (via drill 0.35)
  Top 0.254: IC6.4 32.51,55.88 31.88,55.24 28.7,55.24 28.64,55.31 | 28.64,55.31 27.18,56.77 27.18,60.96 26.42,61.72 26.42,72.64 X1.29 | CONN1.47 12.7,13.21 10.16,15.75 10.16,19.18 7.87,21.46 7.87,22.23 11.94,26.29 11.94,33.53 v14.35,35.94 | v17.27,35.94 28.57,47.24 28.57,55.24 28.64,55.31
  Bottom 0.254: v17.27,35.94 v14.35,35.94
A15  (via drill 0.35)
  Top 0.254: v18.03,10.03 17.78,10.03 v13.97,13.84 | v23.75,50.42 v19.3,45.97
  Bottom 0.254: IC6.5 29.72,53.34 28.89,54.17 | 28.89,54.17 28.83,54.23 28.83,57.78 20.32,66.29 X1.31 | CONN1.48 12.7,4.7 14.1,6.1 14.1,6.86 14.86,7.62 15.62,7.62 v18.03,10.03 | v13.97,13.84 13.21,13.84 12.19,14.86 12.19,30.86 12.95,31.62 16.89,31.62 22.48,37.21 23.37,37.21 23.88,37.72 23.88,40.89 19.3,45.47 v19.3,45.97 | v23.75,50.42 25.15,50.42 28.89,54.17
D0  (via drill 0.35)
  Top 0.254: v69.22,52.7 69.22,56.13 68.07,57.28 66.29,57.28 65.41,58.17 65.41,75.31 61.98,78.74 X1.2 | v61.59,13.84 63.5,13.84 v66.17,16.51 | v70.74,47.62 67.94,47.62 IC1.34
  Bottom 0.254: IC1.34 67.31,48.64 69.22,50.55 v69.22,52.7 | CONN1.25 40.64,8.51 44.7,12.57 60.33,12.57 v61.59,13.84 | v66.17,16.51 70.48,16.51 78.23,24.26 79.25,24.26 80.39,25.4 80.39,38.1 78.99,39.5 75.06,39.5 70.74,43.81 v70.74,47.62
D1  (via drill 0.35)
  Top 0.254: IC1.33 77.09,45.72 78.49,47.12 79.25,47.12 80.9,48.77 80.9,81.15 79.38,82.68 59.56,82.68 55.88,78.99 X1.4 | v49.28,37.47 51.05,39.24 v59.05,39.24
  Bottom 0.254: CONN1.26 40.64,4.7 39.37,5.97 39.37,11.18 45.34,17.14 45.59,17.14 48.51,20.07 48.51,36.7 v49.28,37.47 | v59.05,39.24 60.83,39.24 IC1.33
D2  (via drill 0.35)
  Top 0.254: v62.99,44.7 64.52,43.18 IC1.32 70.87,39.62 v70.87,35.56 | v53.98,67.44 53.98,75.18 54.48,75.69 54.48,77.6 X1.6 | CONN1.27 38.99,6.35 40.39,4.95 41.15,4.95 41.78,4.32 41.78,3.17 42.55,2.41 53.59,2.41 54.74,3.56 54.74,4.32 55.63,5.21 61.47,5.21 62.36,6.1 62.36,6.86 65.79,10.29 v73.28,10.29 | v77.34,20.95 77.34,23.11 76.07,24.38 71.88,24.38 v71.5,24
  Bottom 0.254: v62.99,44.7 61.98,44.7 61.09,43.81 58.29,43.81 56.77,45.34 56.77,50.8 52.83,54.74 51.05,54.74 50.29,55.5 50.29,63.88 53.85,67.44 v53.98,67.44 | v73.28,10.29 77.09,14.1 77.09,15.24 78.49,16.64 79.25,16.64 79.88,17.27 79.88,18.29 78.99,19.18 78.23,19.18 77.34,20.07 v77.34,20.95 | v71.5,24 70.87,23.37 70.1,23.37 69.72,23.75 69.72,24.89 70.87,26.04 v70.87,35.56
D3  (via drill 0.35)
  Top 0.254: v68.45,54.61 66.42,54.61 64.64,56.39 v64.64,71.25 | CONN1.28 37.21,3.81 35.81,5.21 29.97,5.21 29.08,6.1 29.08,9.65 25.02,13.72 25.02,19.18 25.78,19.94 25.78,36.32 v25.02,37.08 | v16.76,53.85 16.76,55.24 14.73,57.28 12.95,57.28 10.79,59.44 10.79,70.87 20.7,80.77 29.72,80.77 30.1,81.15 35.94,81.15 v37.21,79.88
  Bottom 0.254: IC1.31 67.31,41.02 69.98,43.69 69.98,53.09 v68.45,54.61 | v64.64,71.25 61.72,71.25 57.02,75.95 57.02,76.71 56.13,77.6 51.94,77.6 | X1.8 51.94,77.6 | v25.02,37.08 25.02,40.51 20.07,45.47 20.07,50.55 v16.76,53.85 | v37.21,79.88 38.61,79.88 39.5,78.99 39.5,75.18 41.91,72.77 49.02,72.77 51.94,75.69 51.94,77.6
D4  (via drill 0.35)
  Top 0.254: IC1.30 67.31,38.48 62.23,43.56 v62.23,46.23 | v62.23,52.83 61.85,52.83 58.67,56.01 v58.67,61.59 | v57.53,62.74 49.4,70.87 49.4,77.6 X1.10 | CONN1.29 34.92,6.35 v31.24,10.03 | v25.78,15.49 25.78,19.18 28.96,22.35 28.96,25.02 28.7,25.27 28.7,28.57 v29.84,29.72 | v33.15,42.55 42.16,42.55 45.34,45.72 45.85,45.72 v46.74,46.61 | v48.13,44.96 50.67,44.96 51.05,44.58 v58.67,44.58
  Bottom 0.254: v62.23,52.83 v62.23,46.23 62.23,45.72 61.09,44.58 v58.67,44.58 | v57.53,62.74 v58.67,61.59 | v25.78,15.49 v31.24,10.03 | v29.84,29.72 29.84,31.62 31.24,33.02 31.62,33.02 32,33.4 32,40.77 33.15,41.91 v33.15,42.55 | v46.74,46.61 46.74,46.35 v48.13,44.96
D5  (via drill 0.35)
  Top 0.254: IC1.29 66.8,35.56 65.53,34.29 56.64,34.29 55.88,35.05 54.23,35.05 v53.98,34.8 | 49.78,64.9 49.78,67.18 46.86,70.1 46.86,77.6 X1.12 | 49.78,64.9 v49.78,53.47 | CONN1.30 34.67,3.81 33.53,2.67 v31.37,2.67 | v37.08,18.92 v37.08,13.21 | v38.48,43.94 41.53,43.94 v45.09,47.5 | 49.78,64.9 v46.61,64.9
  Bottom 0.254: v53.98,34.8 53.98,42.16 54.61,42.8 54.61,50.42 52.83,52.2 51.05,52.2 v49.78,53.47 | v31.37,2.67 29.97,2.67 29.34,3.3 29.34,4.32 30.23,5.21 30.99,5.21 31.88,6.1 31.88,8 v37.08,13.21 | v37.08,18.92 37.08,19.81 38.61,21.34 38.61,43.81 v38.48,43.94 | v45.09,47.5 45.09,54.99 46.1,56.01 46.1,64.39 v46.61,64.9
D6  (via drill 0.35)
  Top 0.254: v69.22,34.92 70.36,34.92 70.48,34.8 72.39,34.8 74.93,37.34 v74.93,40.77 | v80.14,53.09 80.14,54.86 80.39,55.12 80.39,66.04 78.99,67.44 74.04,67.44 61.21,80.26 v58.29,80.26 | v43.81,8.26 v34.16,8.26 | v56.77,11.81 56.77,16.13 56.01,16.89 56.01,17.91 56.52,18.41 63.37,18.41 v63.5,18.29 | v60.33,24.64 60.33,26.04 IC1.28
  Bottom 0.254: v69.22,34.92 IC1.28 | v74.93,40.77 74.93,48.64 78.49,52.2 79.25,52.2 v80.14,53.09 | v58.29,80.26 57.66,80.9 51.31,80.9 49.4,78.99 49.4,75.69 46.99,73.28 42.16,73.28 41.78,73.66 41.78,77.34 X1.14 | CONN1.31 33.02,7.11 v34.16,8.26 | v43.81,8.26 44.45,8.26 44.58,8.38 55.5,8.38 57.28,6.6 57.28,5.84 58.17,4.95 58.93,4.95 59.82,4.06 59.82,3.3 60.45,2.67 61.47,2.67 62.1,3.3 62.1,6.86 60.07,8.89 59.69,8.89 v56.77,11.81 | v63.5,18.29 63.5,21.72 60.58,24.64 v60.33,24.64
D7  (via drill 0.35)
  Top 0.254: v60.45,23.62 IC1.27 | v48.64,14.61 48.64,7.62 49.4,6.86 49.4,5.84 48.77,5.21 v42.16,5.21 | X1.16 40.64,77.85 42.04,76.45 42.04,75.69 44.83,72.9 44.83,65.53 49.28,61.09 49.28,54.1 49.02,53.85 49.02,53.09 49.91,52.2 56.52,52.2 v56.64,52.32 | v57.53,46.35 57.02,46.35 v56.01,45.34 | v54.74,31.88 54.74,30.73 v53.21,29.21
  Bottom 0.254: v60.45,23.62 57.53,23.62 52.83,18.92 51.05,18.92 50.99,18.86 | 50.99,18.86 48.64,16.51 v48.64,14.61 | v42.16,5.21 42.16,4.83 41.78,4.45 41.78,3.3 41.15,2.67 34.16,2.67 CONN1.32 | v56.64,52.32 56.64,51.94 57.53,51.05 v57.53,46.35 | v56.01,45.34 56.01,41.66 54.74,40.39 v54.74,31.88 | v53.21,29.21 51.18,29.21 49.53,27.56 49.53,20.32 50.99,18.86
E0H
  Top 0.254: IC4.9 15.62,45.72 22.99,53.09 22.99,54.74 CS_LB.1
F0H
  Bottom 0.254: IC4.7 6.73,48.26 13.08,54.61 22.86,54.61 CS_LB.3
F8H
  Bottom 0.254: IC3.15 19.94,30.48 21.08,31.62 22.99,31.62 CS_HB.1
F9H
  Top 0.254: IC3.14 19.94,27.94 21.08,29.08 22.99,29.08 CS_HB.3
FAH
  Top 0.254: IC3.13 19.94,25.4 21.08,26.54 22.99,26.54 CS_HB.5
FBH
  Top 0.254: IC3.12 19.94,22.86 21.08,21.72 22.99,21.72 CS_HB.7
GND  (via drill 0.35)
  Top 0.508: IC6.13 41.91,59.69 | 41.91,59.69 IC6.12 | X2.2 78.74,78.36 73.79,73.41 v73.79,71.5 | v48.26,59.69 41.91,59.69 | CONN1.49 6.35,10.16 IC3.8 6.22,15.37 5.97,15.37 4.19,17.14 v4.19,26.16 | v5.46,35.94 C5.1 6.35,39.37 IC4.8 6.22,45.59 3.05,48.77 3.05,63.37 7.62,67.94 C3.1 7.75,68.71 7.75,73.66 16.51,82.42 v16.51,82.68 | v45.09,23.62 v45.09,18.16 | v67.82,12.06 59.31,12.06 v57.78,13.59 | v40.39,10.67 37.97,10.67 34.29,14.35 IC5.7 | IC5.13 41.66,30.48 35.56,36.58 C4.1 35.43,38.23 v22.86,38.23
  Bottom 0.508: C2.1 35.56,67.06 41.66,60.96 IC6.13 | IC1.7 51.18,48.26 48.64,50.8 48.64,59.69 | 48.64,59.69 48.64,63.75 53.47,68.58 C1.1 58.67,70.1 65.15,70.1 66.55,71.5 v73.79,71.5 | 48.64,59.69 v48.26,59.69 | v4.19,26.16 4.19,26.67 3.68,27.18 3.68,34.16 v5.46,35.94 | C4.1 35.56,46.99 IC6.7 | IC5.7 39.12,17.78 40.64,16.26 43.18,16.26 v45.09,18.16 | v45.09,23.62 45.09,25.65 42.8,27.94 IC5.12 IC5.13 | CONN1.2 71.12,4.19 72.64,5.71 72.64,7.24 v67.82,12.06 | v57.78,13.59 49.28,13.59 49.15,13.46 43.18,13.46 v40.39,10.67 | C5.1 10.67,38.1 12.19,39.62 13.34,39.62 14.73,38.23 v22.86,38.23 | X2.2 65.02,78.74 58.8,84.96 18.8,84.96 v16.51,82.68
  pour Bottom: -1.27,87.63 -1.27,-1.27 85.09,-1.27 85.09,87.63
PA0
  Bottom 0.254: IC1.4 62.61,55.88 66.55,59.82 79.25,59.82 80.39,60.96 80.39,69.47 X2.5
PA1
  Bottom 0.254: IC1.3 62.61,58.42 66.55,62.36 79.25,62.36 79.88,62.99 79.88,67.44 X2.6
PA2
  Top 0.254: IC1.2 52.96,60.96 61.98,51.94 75.69,51.94 78.49,54.74 79.25,54.74 79.88,55.37 79.88,64.9 X2.7
PA3
  Bottom 0.254: IC1.1 65.15,63.5 66.29,64.64 77.6,64.64 X2.8
PA4
  Top 0.254: IC1.40 76.2,63.5 X2.9
PA5
  Top 0.254: IC1.39 76.2,60.96 X2.10
PA6
  Top 0.254: IC1.38 76.2,58.42 X2.11
PA7
  Bottom 0.254: IC1.37 76.2,55.88 X2.12
PB0  (via drill 0.35)
  Top 0.254: v50.29,27.18 50.29,30.86 51.31,31.88 53.09,31.88 v55.5,34.29 | v55.5,40.01 59.44,43.94 59.44,46.74 62.36,49.66 77.6,49.66 X2.13
  Bottom 0.254: IC1.18 52.07,20.7 50.29,22.48 v50.29,27.18 | v55.5,40.01 v55.5,34.29
PB1
  Top 0.254: IC1.19 51.69,17.78 48.51,20.95 48.51,34.16 51.31,36.96 57.91,36.96 59.94,38.99 59.94,46.48 60.45,46.99 70.23,46.99 70.36,46.86 77.34,46.86 X2.14
PB2  (via drill 0.35)
  Top 0.254: v56.26,20.32 57.91,20.32 58.67,21.08 65.91,21.08 66.29,21.46 68.33,21.46 69.34,20.45 70.1,20.45 70.48,20.83 v70.48,24.13 | v72.01,35.56 72.01,38.99 X2.15
  Bottom 0.254: IC1.20 52.45,15.24 56.26,19.05 v56.26,20.32 | v70.48,24.13 70.48,24.89 71.5,25.91 71.5,35.05 v72.01,35.56
PB3
  Bottom 0.254: IC1.21 69.98,15.24 76.45,21.72 79.25,21.72 80.9,23.37 80.9,41.02 X2.16
PB4
  Top 0.254: IC1.22 67.69,17.78 69.22,19.3 75.31,19.3 75.56,19.05 79.12,19.05 80.9,20.83 80.9,38.48 X2.17
PB5  (via drill 0.35)
  Top 0.254: v64.14,17.14 63.75,17.14 60.83,14.22 60.83,13.46 61.21,13.08 v68.83,13.08 | v74.93,13.08 78.49,16.64 79.25,16.64 80.26,17.65 v80.26,19.05 | v80.14,21.46 80.14,28.57 80.39,28.83 80.39,36.45 X2.18
  Bottom 0.254: v64.14,17.14 IC1.23 | v74.93,13.08 v68.83,13.08 | v80.26,19.05 80.26,21.34 v80.14,21.46
PB6
  Bottom 0.254: IC1.24 67.31,23.24 70.1,26.04 70.1,35.94 70.48,36.32 77.98,36.32 X2.19
PB7
  Top 0.254: IC1.25 71.12,25.4 X2.20
PC0
  Bottom 0.254: IC1.14 58.67,30.48 65.02,36.83 79.12,36.83 79.88,36.07 79.88,31.62 X2.21
PC1
  Top 0.254: IC1.15 60.07,27.94 66.29,34.16 79.25,34.16 79.88,33.53 79.88,29.08 X2.22
PC2
  Bottom 0.254: IC1.16 61.21,25.4 64.9,21.72 69.09,21.72 70.23,22.86 76.07,22.86 78.61,25.4 X2.23
PC3
  Top 0.254: IC1.17 62.99,22.86 64.39,24.26 69.47,24.26 70.1,24.89 76.71,24.89 X2.24
PC4
  Top 0.254: IC1.13 50.16,33.02 49.02,31.88 49.02,21.21 51.18,19.05 68.2,19.05 68.96,19.81 75.56,19.81 75.82,19.56 77.98,19.56 X2.25
PC5  (via drill 0.35)
  Top 0.254: IC1.12 62.61,35.56 v63.88,36.83 | v75.69,34.92 v75.69,37.59 | v75.69,23.62 75.69,20.83 v76.2,20.32
  Bottom 0.254: v63.88,36.83 66.29,39.24 73.91,39.24 75.56,37.59 v75.69,37.59 | v75.69,23.62 v75.69,34.92 | X2.26 v76.2,20.32
PC6  (via drill 0.35)
  Top 0.254: v50.04,31.75 50.04,31.37 49.53,30.86 49.53,23.24 51.31,21.46 53.98,21.46 55.88,19.56 58.29,19.56 v58.55,19.81
  Bottom 0.254: IC1.11 52.07,37.72 50.04,35.69 v50.04,31.75 | v58.55,19.81 69.72,8.64 69.72,3.17 70.48,2.41 71.75,2.41 77.6,8.26 77.6,14.1 X2.27
PC7
  Top 0.254: IC1.10 51.31,40.64 47.24,36.58 47.24,17.14 53.34,11.05 77.09,11.05 X2.28
RESET
  Top 0.254: IC6.8 49.53,48.26 50.93,49.66 53.09,49.66 54.99,51.56 61.59,51.56 62.36,50.8 IC1.35
  Bottom 0.254: X1.32 20.32,77.85 21.46,76.71 21.46,75.31 20.83,74.68 20.83,69.72 33.53,57.02 35.31,57.02 40.13,52.2 40.13,50.04 IC6.8
VCC  (via drill 0.35)
  Top 0.508: IC5.14 41.91,36.83 C4.2 40.51,38.23 37.47,38.23 34.8,40.89 30.86,40.89 v28.83,42.93 | C5.2 12.7,41.02 23.5,51.82 24.77,51.82 | 24.77,51.82 25.65,52.7 25.65,56.52 22.99,59.18 19.18,59.18 17.53,60.83 | 17.53,60.83 14.86,63.5 IC4.16 | v24.89,46.86 24.89,51.69 24.77,51.82 | IC6.14 41.91,67.31 C2.2 | v65.02,35.31 65.02,39.5 60.96,43.56 v60.96,45.97 | v61.34,54.86 61.34,64.14 62.23,65.02 C1.2 | v59.31,2.29 71.75,2.29 72.64,3.17 72.64,6.99 70.36,9.27 v67.56,9.27 | v57.4,21.34 57.66,21.34 58.29,21.97 63.63,21.97 v64.9,23.24 | X2.1 78.74,80.9 72.64,74.8 v72.64,70.36 | v49.91,68.58 50.16,68.58 v53.34,65.41 | v25.4,68.71 17.53,60.83 | v29.46,70.99 30.86,69.6 30.86,69.47 33.27,67.06 v37.34,67.06
  Bottom 0.508: IC3.16 13.97,34.67 12.7,35.94 C5.2 | IC4.16 13.97,67.31 C3.2 | v24.89,46.86 v28.83,42.93 | v65.02,35.31 65.02,29.97 67.06,27.94 IC1.26 66.93,27.81 64.9,25.78 v64.9,23.24 | v60.96,45.97 60.96,54.48 v61.34,54.86 | CONN1.24 43.56,3.81 45.09,2.29 v59.31,2.29 | v67.56,9.27 67.56,9.53 58.42,18.67 58.04,18.67 57.4,19.3 v57.4,21.34 | v72.64,70.36 66.93,70.36 65.15,68.58 C1.2 59.05,65.41 v53.34,65.41 | v49.91,68.58 C2.2 | v25.4,68.71 25.78,68.71 28.07,70.99 v29.46,70.99 | v37.34,67.06 38.35,67.06 IC6.14
  pour Top: -1.27,87.63 -1.27,-1.27 83.82,-1.27 83.82,87.63

### Text on the board
tNames: D7 | D6 | D5 | D4 | D3 | D2 | D1 | D0 | RSET | !CS | !IOWR | IORD | !RESET | !WR | !RD | !IORQ | VCC | GND | !IORD | A15 | A14 | A13 | A12 | A11 | A10 | A9 | A8 | A7 | A6 | A5 | A4 | A3 | A2 | A1 | A0 | !IOWR | A0 | E0 | F0 | A7 | B0 | RABS664 Z80 PIO V1.4 | B7 | F8 | C0 | F9 | FA | FB | C7